# EAGLE schematic g3528-plcc2-led-breakout (EAGLE 6.2)
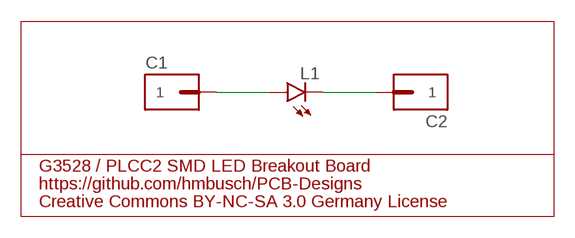
[diagram p0: schematic, sheet 1]

## Parts
C1  PIN_HEADER_1-WIDE  [BREAKAWAY_STRAIGHT_1_WIDE]
C2  PIN_HEADER_1-WIDE  [BREAKAWAY_STRAIGHT_1_WIDE]
L1  LED-G3528  [G3528]

## Nets
N$1: C1.1 L1.A(ANODE)
N$2: C2.1 L1.C(CATHODE)

## Notes on the sheet
- G3528 / PLCC2 SMD LED Breakout Board
- https://github.com/hmbusch/PCB-Designs
- Creative Commons BY-NC-SA 3.0 Germany License

## Library data of the parts
C1 C2 = icmi-connectors:PIN_HEADER_1
L1 = icmi-leds:LED: Standard LED 0.1 inch spacing